# Altium schematic sheet 8V_Buck_LDO_Power.SchDoc
size 215 x 139 mm; SheetNumber: 4; SheetTotal: 6
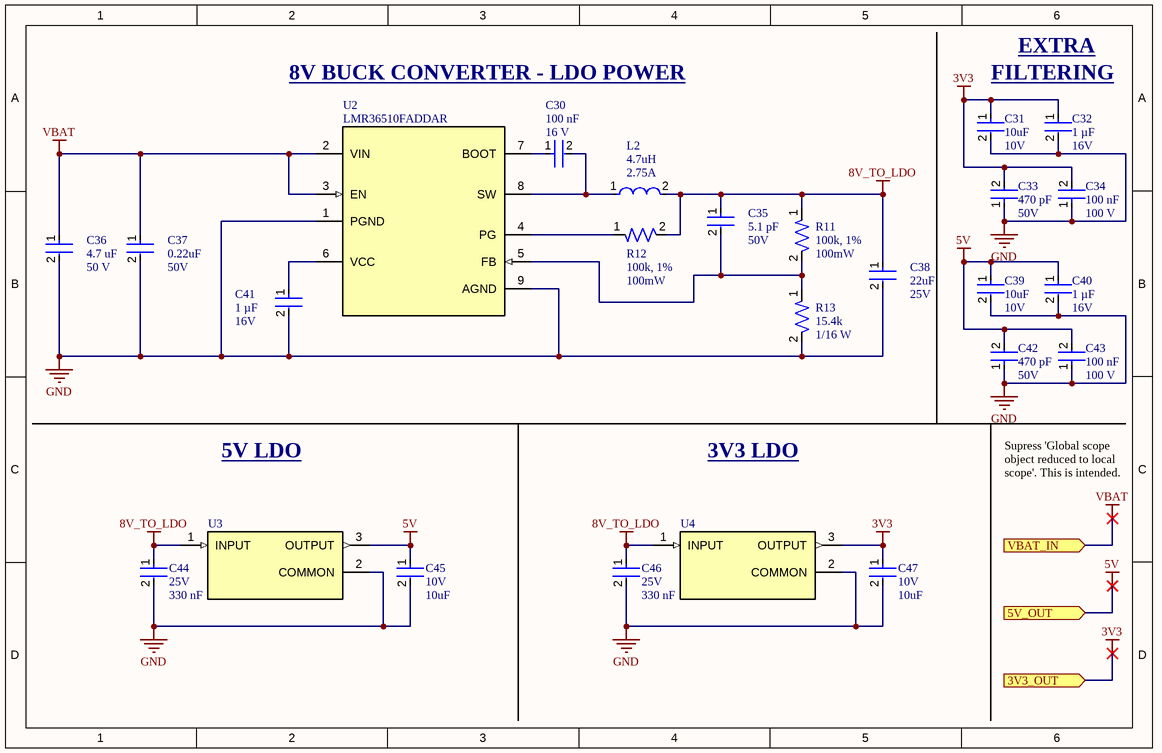
[diagram p0: 8V_Buck_LDO_Power.SchDoc]

## Parts
C30  Voltage Rating: 16 V  Capacitance: 100 nF  [FP-CC0402-IPC_B]  (hidden comment: CC0402KRX7R7BB104)
C31  Rated Voltage: 10V  Capacitance: 10uF  [FP-CC0603-DC-MFG]  (hidden comment: CC0603KRX5R6BB106)
C32  Capacitance: 1 µF  Voltage: 16V  [FP-CC0603-DA-MFG]  (hidden comment: CC0603KRX7R7BB105)
C33  Voltage: 50V  Capacitance: 470 pF  [CAP_CC0805_YAG-L]  (hidden comment: CC0805JRNPO9BN471)
C34  Capacitance: 100 nF  Voltage: 100 V  [CAP-0603]  (hidden comment: CC0603KRX7R0BB104)
C35  Voltage Rating: 50V  Capacitance: 5.1 pF  [CAPC1005X55N]  (hidden comment: CC0402CRNPO9BN5R1)
C36  Voltage Rating: 50 V  Capacitance: 4.7 uF  [FP-CC0805-0_85-MFG]  (hidden comment: CC0805KKX5R9BB475)
C37  Capacitance: 0.22uF  Voltage: 50V  [CAP_CC0603_YAG]  (hidden comment: CC0603JRX7R9BB224)
C38  Voltage - Rated: 25V  Capacitance: 22uF  [FP-GRM32-MFG]  (hidden comment: GRM32ER61E226KE15L)
C39  Rated Voltage: 10V  Capacitance: 10uF  [FP-CC0603-DC-MFG]  (hidden comment: CC0603KRX5R6BB106)
C40  Capacitance: 1 µF  Voltage: 16V  [FP-CC0603-DA-MFG]  (hidden comment: CC0603KRX7R7BB105)
C41  Capacitance: 1 µF  Voltage: 16V  [FP-CC0603-DA-MFG]  (hidden comment: CC0603KRX7R7BB105)
C42  Voltage: 50V  Capacitance: 470 pF  [CAP_CC0805_YAG-L]  (hidden comment: CC0805JRNPO9BN471)
C43  Capacitance: 100 nF  Voltage: 100 V  [CAP-0603]  (hidden comment: CC0603KRX7R0BB104)
C44  Rated Voltage: 25V  Capacitance: 330 nF  [FP-CC0603-DA-MFG]  (hidden comment: CC0603KRX7R8BB334)
C45  Rated Voltage: 10V  Capacitance: 10uF  [FP-CC0603-DC-MFG]  (hidden comment: CC0603KRX5R6BB106)
C46  Rated Voltage: 25V  Capacitance: 330 nF  [FP-CC0603-DA-MFG]  (hidden comment: CC0603KRX7R8BB334)
C47  Rated Voltage: 10V  Capacitance: 10uF  [FP-CC0603-DC-MFG]  (hidden comment: CC0603KRX5R6BB106)
L2  Inductance: 4.7uH  Current Rating: 2.75A  [IND-4.7UH-0001]  (hidden comment: CDRH104NP-221MC)
R11  Power: 100mW  Resistance: 100k, 1%  [FP-RC0603-0_55-IPC_B]  (hidden comment: RC0603FR-07100KL)
R12  Power: 100mW  Resistance: 100k, 1%  [FP-RC0603-0_55-IPC_B]  (hidden comment: RC0603FR-07100KL)
R13  Power Rating: 1/16 W  Resistance: 15.4k  [FP-AC0402-MFG]  (hidden comment: AC0402FR-0715K4L)
U2  LMR36510FADDAR  [DDA0008J]
U3  UA78M05IDCYR  [FP-DCY0004A-IPC_B]  (value not drawn)
U4  UA78M33CDCYR  [VREG_UA78M33CDCYR]  (value not drawn)

## Ports
3V3_OUT (in, see TLD[5B]), 5V_OUT (in, see TLD[5B]), VBAT_IN (in, see TLD[6B], 12V_Buck_Motor[1A])

## Nets
3V3: C31.1 C32.1 C33.2 C34.2 C47.1 U4.3(OUTPUT) ; port 3V3_OUT
5V: C39.1 C40.1 C42.2 C43.2 C45.1 U3.3(OUTPUT) ; port 5V_OUT
8V_TO_LDO: C35.1 C38.1 C44.1 C46.1 L2.2 R11.1 R12.2 U3.1(INPUT) U4.1(INPUT)
GND: C31.2 C32.2 C33.1 C34.1 C36.2 C37.2 C38.2 C39.2 C40.2 C41.2 C42.1 C43.1 C44.2 C45.2 C46.2 C47.2 R13.2 U2.1(PGND) U2.9(AGND) U3.2(COMMON) U4.2(COMMON)
VBAT: C36.1 C37.1 U2.2(VIN) U2.3(EN) ; port VBAT_IN
NetC30_1: C30.1 U2.7(BOOT)
NetC30_2: C30.2 L2.1 U2.8(SW)
NetC35_2: C35.2 R11.2 R13.1 U2.5(FB)
NetC41_1: C41.1 U2.6(VCC)
NetR12_1: R12.1 U2.4(PG)

## Notes on the sheet
- 8V BUCK CONVERTER - LDO POWER
- FILTERING
- EXTRA
- 5V LDO
- 3V3 LDO
- Supress 'Global scope object reduced to local scope'. This is intended.
- DWG. NO.
- REV.
- SHT.
- REVISION
- DESCRIPTION
- DATE
- APPROVED
- THIS DOCUMENT AND THE DATA DISCLOSED HEREIN OR HEREWITH IS THE PROPERTY OF ALTIUM LIMITED AND MAY BE FREELY DISTRIBUTED IN WHOLE. NO RIGHTS ARE RESERVED OR EXPRESS OR IMPLIED WARANTEE GIVEN.
- ENG:
- DSN:
- APPROVALS
- PROJECT
- DOCUMENT REVISION:
- DESIGN ITEM:
- CHK:
- BOM:
- REFERENCE DOCUMENTS
- PROJECT REVISION:
- TITLE
- FAB DWG:
- PCB DWG:
- ASSY DWG:
- SCALE:
- SIZE
- C
- CAGE CODE
- FILE NAME
- DWG NO.
- SHEET
- OF
- REV

## Library data of the parts
C30 = CAP-0.1U-0001: CAP CER 0.1UF 16V X7R 0402; Manufacturer: YAGEO; Material: Ceramic; Automotive Grade: NA; Temperature Coefficient: 30ppm/°C; Tolerance: 0.1; Value: 100 nF; Device Class L1: Passive Components; Temperature Range Low: -55°C; Device Class L3: Ceramic Capacitors; Temperature Characteristic: X7R; Ipc Land Pattern Name: CAPC10050X50; Temperature Range High: +125°C; Temperature: -55°C to +125°C; RoHS: TRUE; Automotive: No; Height: 0.55mm; Device Class L2: Capacitors; Digikey Description: CAP CER 0.1UF 16V X7R 0402; Package: CC0402; Footprint Url: http://www.yageo.com/exep/pages/download/literatures/UPY-C_GEN_24.pdf; ComponentLink2Description: Datasheet; Category: Cap; Lead Free: Yes; Octopart: https://octopart.com/cc0402krx7r7bb104-yageo-42244624; ComponentLink2URL: http://www.yageo.com/documents/recent/UPY-GP_NP0_16V-to-50V_16.pdf; Manufacturer Part Number: CC0402KRX7R7BB104; Mouser Description: 0402 0.1 uF 16 V ±10 % Tolerance X7R SMT Multilayer Ceramic Capacitor
C31 C39 C45 C47 = CAP-10U-0001: CAP CER 10UF 10V X5R 0603; Tolerance: 10%; Case/Package: 0603; Length: 0.063inch; Dielectric: X5R; Mount: Surface Mount; Case Code (Metric): 1608; Depth: 0.8mm; Voltage Rating (DC): 10V; Voltage Rating: 10V; Lead Free: Lead Free; Resistor Type: Ceramic; Packaging: Tape and Reel; Max Operating Temperature: 85°C; Termination: SMD/SMT; Min Operating Temperature: -55°C; Weight: 7.1E-05oz; Thickness: 0.035inch; Case Code (Imperial): 0603; Package Quantity: 4000; Halogen Free: Halogen Free; RoHS Compliant: Yes; Width: 0.031inch
C32 C40 C41 = CAP-1U-0002: 1 µF ±10% 16V Ceramic Capacitor X7R 0603 (1608 Metric)
C33 C42 = CAP-470P-0001: CAP CER 470PF 50V C0G/NPO 0805; Mfr_Name: Yageo
C34 C43 = CAP-100N-0001: 0.1 µF ±10% 100V Ceramic Capacitor X7R 0603 (1608 Metric)
C35 = CAP-5.1P-0001: 5.1pF Â±0.25pF 50V Ceramic Capacitor C0G, NP0 0402 (1005 Metric); MF: Yageo; Check_prices: https://www.snapeda.com/parts/CC0402CRNPO9BN5R1/Yageo/view-part/1841461/?ref=eda; SnapEDA_Link: https://www.snapeda.com/parts/CC0402CRNPO9BN5R1/Yageo/view-part/1841461/?ref=snap; Availability: Good; MP: CC0402CRNPO9BN5R1; Purchase-URL: https://pricing.snapeda.com/search/part/CC0402CRNPO9BN5R1/?ref=eda; Package: 0402 Yageo; Price: None; Value: *
C36 = CAP-4.7U-0002: CAP CER 4.7UF 50V X5R 0805; Manufacturer: Yageo; Material: Ceramic; Tolerance: 0.1; Value: 4.7 uF; Height: 0.95mm; Category: Cap; Manufacturer Part Number: CC0805KKX5R9BB475; ComponentLink2Description: Datasheet; Lead Free: Yes; Device Class L2: Capacitors; Temperature Range High: +85°C; ComponentLink2URL: http://www.yageo.com/documents/recent/UPY-GPHC_Y5V_6.3V-to-50V_8.pdf; Ipc Land Pattern Name: CAPC200125X85; Octopart: https://octopart.com/cc0805kkx5r9bb475-yageo-81932641; Temperature Range Low: -30°C; Digikey Description: CAP CER 4.7UF 50V X5R 0805; Package: CC0805-0.85; Device Class L1: Passive Components; RoHS: TRUE; Temperature Characteristic: X5R; Device Class L3: Ceramic Capacitors; Automotive: No; Temperature: -30°C to +85°C; Footprint Url: http://www.yageo.com/exep/pages/download/literatures/UPY-C_GEN_24.pdf
C37 = CAP-0.22U-0001: 0.22 µF ±5% 50V Ceramic Capacitor X7R 0603 (1608 Metric); Mfr_Name: Yageo
C38 = CAP-22U-0001: CAP CER 22UF 25V X5R 1210; Manufacturer: Murata Electronics North America; Possible Substitute: GRM32ER61E226KE15K; Other Names: 490-3889-2; Material: Ceramic; Tolerance: 10%; Digikey Description: CAP CER 22UF 25V X5R 1210; Mouser Description: Multilayer Ceramic Capacitors MLCC - SMD/SMT 1210 22uF 25volts X5R 10%; Device Class L2: Capacitors; Height: 2.7mm; Temperature Characteristic: X5R; Category: Cap; RoHS: TRUE; Operating Temperature: -55°C ~ 85°C; Temperature: -55°C to +85°C; Lead Free: Yes; Package: GRM32; Temperature Range High: +85°C; Package / Case: 1210 (3225 Metric); Standard Package: 1,000; Packaging: Cut Tape (CT); Thickness (Max): 0.106" (2.70mm); Value: 22uF; Automotive: No; Device Class L1: Passive Components; Temperature Range Low: -55°C; Size / Dimension: 0.126" L x 0.098" W (3.20mm x 2.50mm); ComponentLink2Description: Datasheet; Device Class L3: Ceramic Capacitors; Temperature Coefficient: X5R; ComponentLink2URL: https://search.murata.co.jp/Ceramy/image/img/A01X/G101/ENG/GRM32ER61E226KE15-01A.pdf; Voltage Rating: 25V; Manufacturer Part Number: GRM32ER61E226KE15L; Octopart: https://octopart.com/grm32er61e226ke15l-murata-197441; Applications: General Purpose; Mounting Type: Surface Mount, MLCC
C44 C46 = CAP-0.33U-0001: CAP CER 0.33UF 25V X7R 0603; Manufacturer: YAGEO; Temperature Coefficient: 15%; Material: Ceramic; Tolerance: 0.1; Voltage: 25 V; Device Class L3: Ceramic Capacitors; Device Class L2: Capacitors; Voltage Rating: 25 V; Mouser Description: 0603 0.33 uF 25 V ±10 % Tolerance X7R SMT Multilayer Ceramic Capacitor; Automotive: No; ComponentLink2Description: Datasheet; Lead Free: Yes; Height: 0.9mm; Temperature: -55°C to +125°C; Digikey Description: CAP CER 0.33UF 25V X7R 0603; Temperature Range High: +125°C; Octopart: https://octopart.com/cc0603krx7r8bb334-yageo-47255252; Category: Cap; Package: CC0603-DA; Device Class L1: Passive Components; RoHS: TRUE; Manufacturer Part Number: CC0603KRX7R8BB334; Temperature Characteristic: X7R; ComponentLink2URL: http://www.yageo.com/documents/recent/UPY-GPHC_X7R_6.3V-to-50V_18.pdf; Temperature Range Low: -55°C; Footprint Url: http://www.yageo.com/exep/pages/download/literatures/UPY-C_GEN_24.pdf
L2 = IND-4.7U-0001: FIXED IND 220UH 520MA 960MOHM SM
R11 R12 = RES-100k-0001: RES SMD 100K OHM 1% 1/10W 0603; Voltage Rating (DC): 50V; Temperature Coefficient: 100ppm/°C; Working Voltage: 75V; Length: 1.6mm; Lead Free: Lead Free; Number of Terminations: 2; Packaging: Tape and Reel; Voltage Rating: 50V; Termination: SMD/SMT; Width: 0.8mm; Resistor Type: Thick Film; Max Power Dissipation: 100mW; Resistance Tolerance: 1%; Features: Moisture Resistant; Height: 0.45mm; Construction: Rectangular; Case/Package: 0603; Military Standard: Not; Case Code (Imperial): 0603; Series: RC; Technology: THICK FILM; Depth: 0.8mm; RoHS Compliant: Yes; REACH SVHC: No SVHC; Min Operating Temperature: -55°C; Case Code (Metric): 1608; Max Operating Temperature: 155°C; Power Rating: 100mW; Number of Pins: 2; Tolerance: 1%
R13 = RES-15.4K-0001: RES 15.4kΩ ±1% 0.063W 0402; Voltage Rating: 50V; Max Power Dissipation: 63mW; Temperature Coefficient: 100ppm/°C; Case Code (Metric): 1005; Max Operating Temperature: 155°C; Width: 0.5mm; Height: 0.015inch; Packaging: Tape and Reel; Min Operating Temperature: -55°C; Termination: SMD/SMT; Length: 0.039inch; Tolerance: 1%; Series: AC; Features: Moisture Resistant; Case/Package: 0402; Case Code (Imperial): 0402; Resistor Type: Thick Film; RoHS Compliant: Yes; Number of Terminations: 2
U2 = IC-BUCK-0003: Buck Switching Regulator IC Positive Adjustable 1V 1 Output 1A 8-PowerSOIC (0.154", 3.90mm Width); Mfr_Name: Texas Instruments; TYPE: TYPE; RefDes: RefDes
U3 = IC-LDO-0001: IC REG LINEAR 5V 500MA SOT223-4; Manufacturer: Texas Instruments; Min Supply Voltage: 7V; Number Of Outputs: 1; Dropout Voltage: 2V; Max Supply Voltage: 25V; Output Type: Fixed; Max Junction Temp: +125°C; Standoff Height: 0.02mm; Automotive: No; Temperature Range Low: -40°C; Temperature Range High: +125°C; Package: DCY0004A; Lead Free: Yes; Octopart: https://octopart.com/ua78m05idcyr-texas+instruments-525575; Output Current: 500mA; ComponentLink2URL: http://www.ti.com/lit/ds/symlink/ua78m.pdf; Mouser Description: Linear Voltage Regulators 5V 500mA Fixed Pos Voltage Regulator; Device Class L1: Integrated Circuits (ICs); Device Class L3: Voltage Regulators - Linear; RoHS: TRUE; ComponentLink2Description: Datasheet; Output Voltage: 5V; Height: 1.8mm; Temperature: -40°C to +125°C; Manufacturer Part Number: UA78M05IDCYR; Digikey Description: IC REG LINEAR 5V 500MA SOT223-4; Category: IC; Device Class L2: Power Management ICs; Ipc Land Pattern Name: SOT230P700X180-4
U4 = IC-LDO-0002: IC REG LIN 3.3V 500MA SOT223-4; MF: Texas Instruments; Purchase-URL: https://pricing.snapeda.com/search/part/UA78M33CDCYR/?ref=eda; Package: SOT-223-4 Texas Instruments; Value: *; Check_prices: https://www.snapeda.com/parts/UA78M33CDCYR/Texas+Instruments/view-part/?ref=eda; SnapEDA_Link: https://www.snapeda.com/parts/UA78M33CDCYR/Texas+Instruments/view-part/?ref=snap; Availability: In Stock; Price: None; MP: UA78M33CDCYR